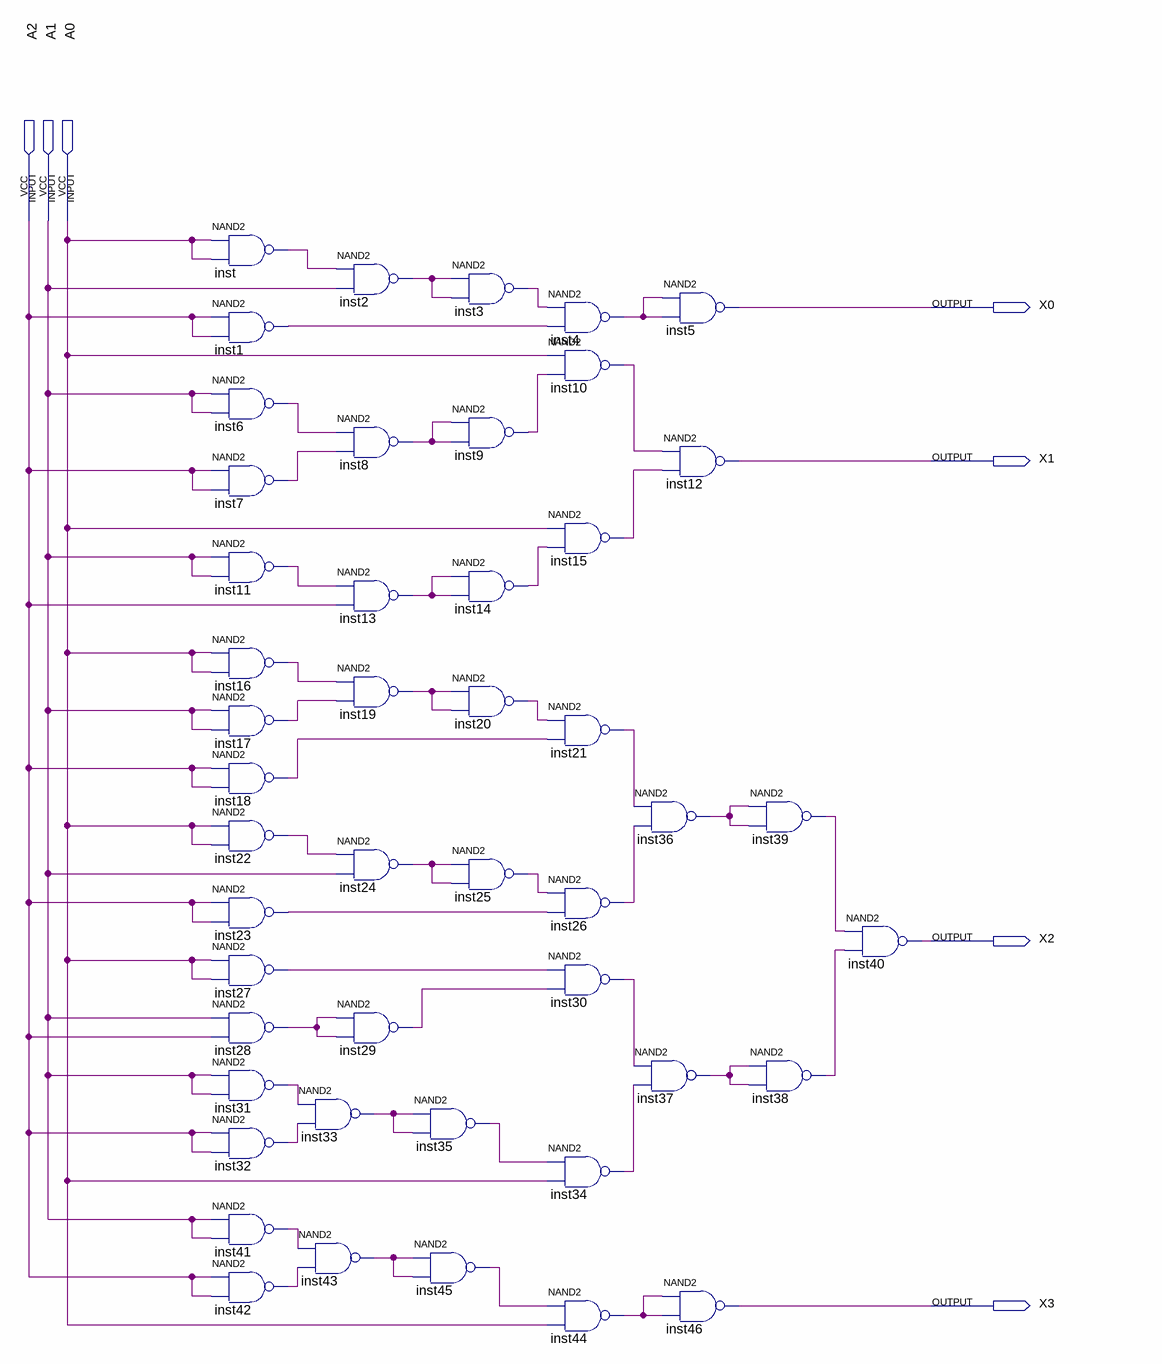
[diagram p0: schematic sheet]
// Quartus schematic decoder_20L274.bdf as structural Verilog: 47 symbols, 7 pins
module decoder_20L274 (
  input  A2,
  input  A1,
  input  A0,
  output X0,
  output X1,
  output X2,
  output X3
);

  wire inst1_out, inst2_out, inst3_out, inst4_out, inst6_out, inst7_out, inst8_out, inst9_out, inst10_out,
       inst11_out, inst13_out, inst14_out, inst15_out, inst16_out, inst17_out, inst18_out, inst19_out,
       inst20_out, inst21_out, inst22_out, inst23_out, inst24_out, inst25_out, inst26_out, inst27_out,
       inst28_out, inst29_out, inst30_out, inst31_out, inst32_out, inst33_out, inst34_out, inst35_out,
       inst36_out, inst37_out, inst38_out, inst39_out, inst41_out, inst42_out, inst43_out, inst44_out,
       inst45_out, inst_out;

  nand inst (inst_out, A0, A0);
  nand inst1 (inst1_out, A2, A2);
  nand inst6 (inst6_out, A1, A1);
  nand inst7 (inst7_out, A2, A2);
  nand inst11 (inst11_out, A1, A1);
  nand inst16 (inst16_out, A0, A0);
  nand inst17 (inst17_out, A1, A1);
  nand inst18 (inst18_out, A2, A2);
  nand inst22 (inst22_out, A0, A0);
  nand inst23 (inst23_out, A2, A2);
  nand inst27 (inst27_out, A0, A0);
  nand inst28 (inst28_out, A1, A2);
  nand inst31 (inst31_out, A1, A1);
  nand inst32 (inst32_out, A2, A2);
  nand inst41 (inst41_out, A1, A1);
  nand inst42 (inst42_out, A2, A2);
  nand inst2 (inst2_out, inst_out, A1);
  nand inst8 (inst8_out, inst6_out, inst7_out);
  nand inst13 (inst13_out, inst11_out, A2);
  nand inst19 (inst19_out, inst16_out, inst17_out);
  nand inst24 (inst24_out, inst22_out, A1);
  nand inst29 (inst29_out, inst28_out, inst28_out);
  nand inst33 (inst33_out, inst31_out, inst32_out);
  nand inst43 (inst43_out, inst41_out, inst42_out);
  nand inst35 (inst35_out, inst33_out, inst33_out);
  nand inst45 (inst45_out, inst43_out, inst43_out);
  nand inst3 (inst3_out, inst2_out, inst2_out);
  nand inst9 (inst9_out, inst8_out, inst8_out);
  nand inst14 (inst14_out, inst13_out, inst13_out);
  nand inst20 (inst20_out, inst19_out, inst19_out);
  nand inst25 (inst25_out, inst24_out, inst24_out);
  nand inst4 (inst4_out, inst3_out, inst1_out);
  nand inst10 (inst10_out, A0, inst9_out);
  nand inst15 (inst15_out, A0, inst14_out);
  nand inst21 (inst21_out, inst20_out, inst18_out);
  nand inst26 (inst26_out, inst25_out, inst23_out);
  nand inst30 (inst30_out, inst27_out, inst29_out);
  nand inst34 (inst34_out, inst35_out, A0);
  nand inst44 (inst44_out, inst45_out, A0);
  nand inst5 (X0, inst4_out, inst4_out);
  nand inst12 (X1, inst10_out, inst15_out);
  nand inst36 (inst36_out, inst21_out, inst26_out);
  nand inst37 (inst37_out, inst30_out, inst34_out);
  nand inst46 (X3, inst44_out, inst44_out);
  nand inst39 (inst39_out, inst36_out, inst36_out);
  nand inst38 (inst38_out, inst37_out, inst37_out);
  nand inst40 (X2, inst39_out, inst38_out);
endmodule
